# Altium schematic sheet 05_CONNECTOR_OUT.SchDoc
size 420 x 297 mm; SheetNumber: 6; SheetTotal: 33
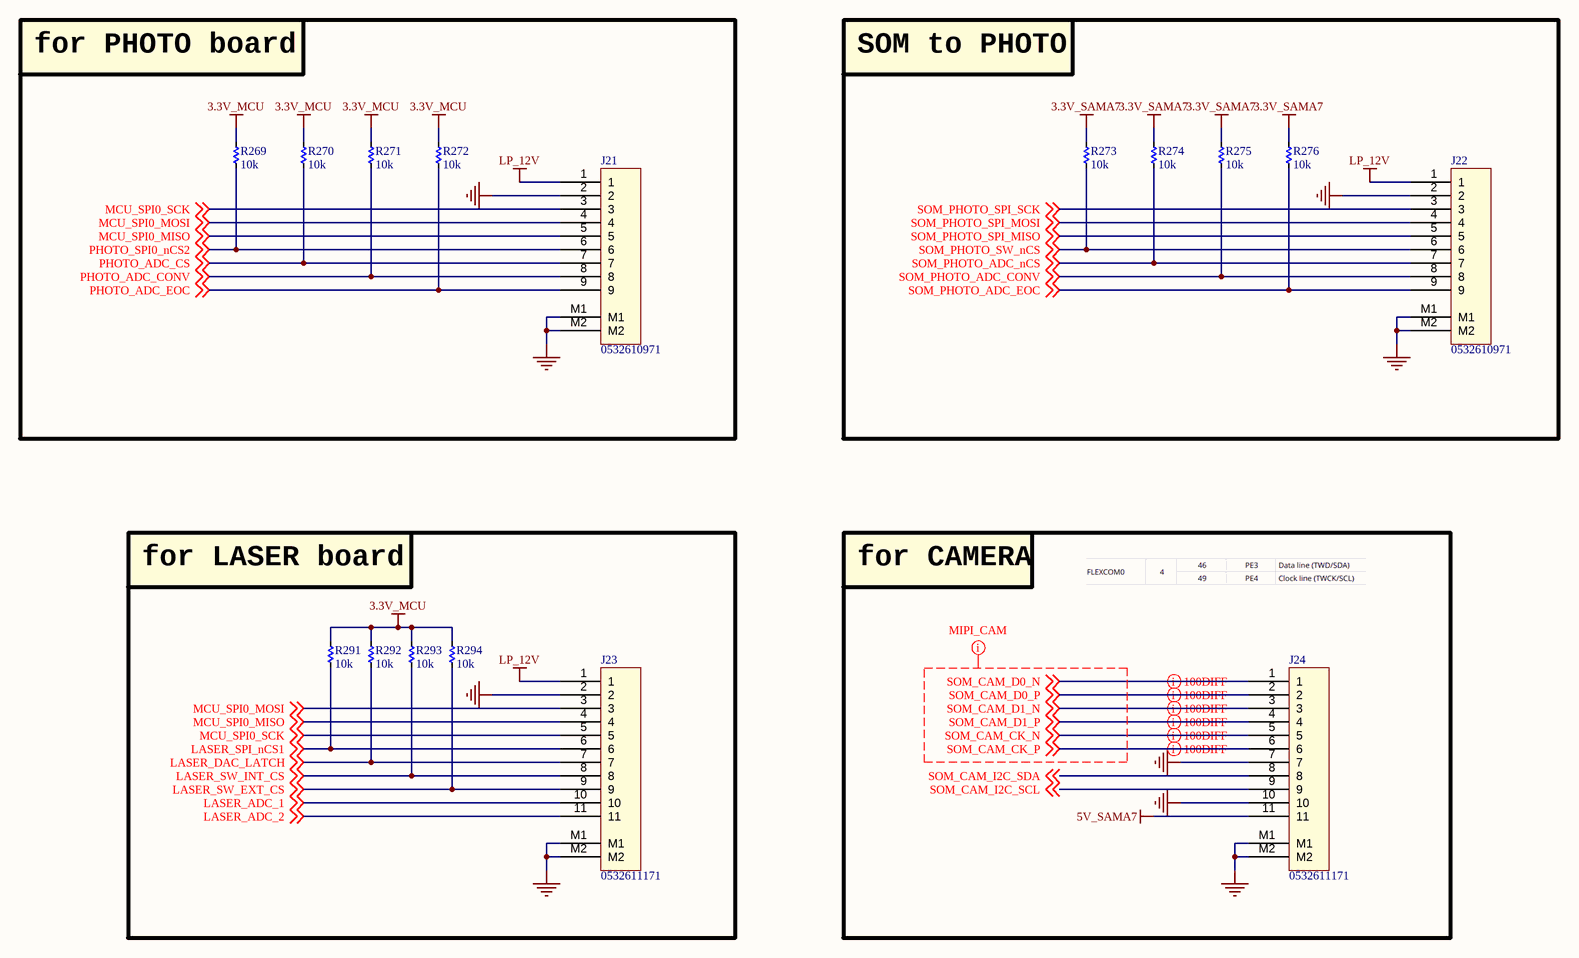
[diagram p0: 05_CONNECTOR_OUT.SchDoc]

## Parts
J21  0532610971  [MOLEX_0532610971]
J22  0532610971  [MOLEX_0532610971]
J23  0532611171  [MOLEX_0532611171]
J24  0532611171  [MOLEX_0532611171]
R269  10k  [RES_C_1005x30_L]
R270  10k  [RES_C_1005x30_L]
R271  10k  [RES_C_1005x30_L]
R272  10k  [RES_C_1005x30_L]
R273  10k  [RES_C_1005x30_L]
R274  10k  [RES_C_1005x30_L]
R275  10k  [RES_C_1005x30_L]
R276  10k  [RES_C_1005x30_L]
R291  10k  [RES_C_1005x30_L]
R292  10k  [RES_C_1005x30_L]
R293  10k  [RES_C_1005x30_L]
R294  10k  [RES_C_1005x30_L]

## Blocks framed on the sheet
for PHOTO board: J21 R269-R272
SOM to PHOTO: J22 R273-R276
for LASER board: J23 R291-R294
for CAMERA: J24

## Nets
3.3V_MCU: R269.1 R270.1 R271.1 R272.1 R291.1 R292.1 R293.1 R294.1
3.3V_SAMA7: R273.1 R274.1 R275.1 R276.1
5V_SAMA7: J24.11
GND: J21.2 J21.M1 J21.M2 J22.2 J22.M1 J22.M2 J23.2 J23.M1 J23.M2 J24.7 J24.10 J24.M1 J24.M2
LP_12V: J21.1 J22.1 J23.1
LASER_ADC_1: J23.10 ; off-sheet LASER_ADC_1
LASER_ADC_2: J23.11 ; off-sheet LASER_ADC_2
LASER_DAC_LATCH: J23.7 R292.2 ; off-sheet LASER_DAC_LATCH
LASER_SPI_nCS1: J23.6 R291.2 ; off-sheet LASER_SPI_nCS1
LASER_SW_EXT_CS: J23.9 R294.2 ; off-sheet LASER_SW_EXT_CS
LASER_SW_INT_CS: J23.8 R293.2 ; off-sheet LASER_SW_INT_CS
MCU_SPI0_MISO: J21.5 J23.4 ; off-sheet MCU_SPI0_MISO
MCU_SPI0_MOSI: J21.4 J23.3 ; off-sheet MCU_SPI0_MOSI
MCU_SPI0_SCK: J21.3 J23.5 ; off-sheet MCU_SPI0_SCK
PHOTO_ADC_CONV: J21.8 R271.2 ; off-sheet PHOTO_ADC_CONV
PHOTO_ADC_CS: J21.7 R270.2 ; off-sheet PHOTO_ADC_CS
PHOTO_ADC_EOC: J21.9 R272.2 ; off-sheet PHOTO_ADC_EOC
PHOTO_SPI0_nCS2: J21.6 R269.2 ; off-sheet PHOTO_SPI0_nCS2
SOM_CAM_CK_N: J24.5 ; off-sheet SOM_CAM_CK_N
SOM_CAM_CK_P: J24.6 ; off-sheet SOM_CAM_CK_P
SOM_CAM_D0_N: J24.1 ; off-sheet SOM_CAM_D0_N
SOM_CAM_D0_P: J24.2 ; off-sheet SOM_CAM_D0_P
SOM_CAM_D1_N: J24.3 ; off-sheet SOM_CAM_D1_N
SOM_CAM_D1_P: J24.4 ; off-sheet SOM_CAM_D1_P
SOM_CAM_I2C_SCL: J24.9 ; off-sheet SOM_CAM_I2C_SCL
SOM_CAM_I2C_SDA: J24.8 ; off-sheet SOM_CAM_I2C_SDA
SOM_PHOTO_ADC_CONV: J22.8 R275.2 ; off-sheet SOM_PHOTO_ADC_CONV
SOM_PHOTO_ADC_EOC: J22.9 R276.2 ; off-sheet SOM_PHOTO_ADC_EOC
SOM_PHOTO_ADC_nCS: J22.7 R274.2 ; off-sheet SOM_PHOTO_ADC_nCS
SOM_PHOTO_SPI_MISO: J22.5 ; off-sheet SOM_PHOTO_SPI_MISO
SOM_PHOTO_SPI_MOSI: J22.4 ; off-sheet SOM_PHOTO_SPI_MOSI
SOM_PHOTO_SPI_SCK: J22.3 ; off-sheet SOM_PHOTO_SPI_SCK
SOM_PHOTO_SW_nCS: J22.6 R273.2 ; off-sheet SOM_PHOTO_SW_nCS

## Layout directives
differential pair; differential pair class DIFF100: SOM_CAM_CK_N, SOM_CAM_CK_P, SOM_CAM_D0_N, SOM_CAM_D0_P, SOM_CAM_D1_N, SOM_CAM_D1_P
net class MIPI_CAM: SOM_CAM_CK_N, SOM_CAM_CK_P, SOM_CAM_D0_N, SOM_CAM_D0_P, SOM_CAM_D1_N, SOM_CAM_D1_P

## Notes on the sheet
- Project:
- BEE-1012
- Sub-system:
- SATELLITE_EXP_CONTROLLER
- Design by:
- SANG HUYNH
- BAO BUI
- Sheet title:
- Sheet
- A3
- of
- Checked by:
- Approved by:
- VU PHAM
- Revision:
- Document No:
- Size:
- Date:

## Library data of the parts
J21 J22 = Header 9x1_2M
J23 J24 = Header 11x1_2M
R269-R276 R291-R294 = _RES_B_2: RES